# Altium schematic sheet RF-Test-Board-Sch.SchDoc
size A4; Organization: Altium Limited; Address1: L3, 12a Rodborough Rd; Address2: Frenchs Forest; Address3: NSW; Address4: Australia 2086; DocumentNumber: 1; SheetNumber: 1; SheetTotal: 7
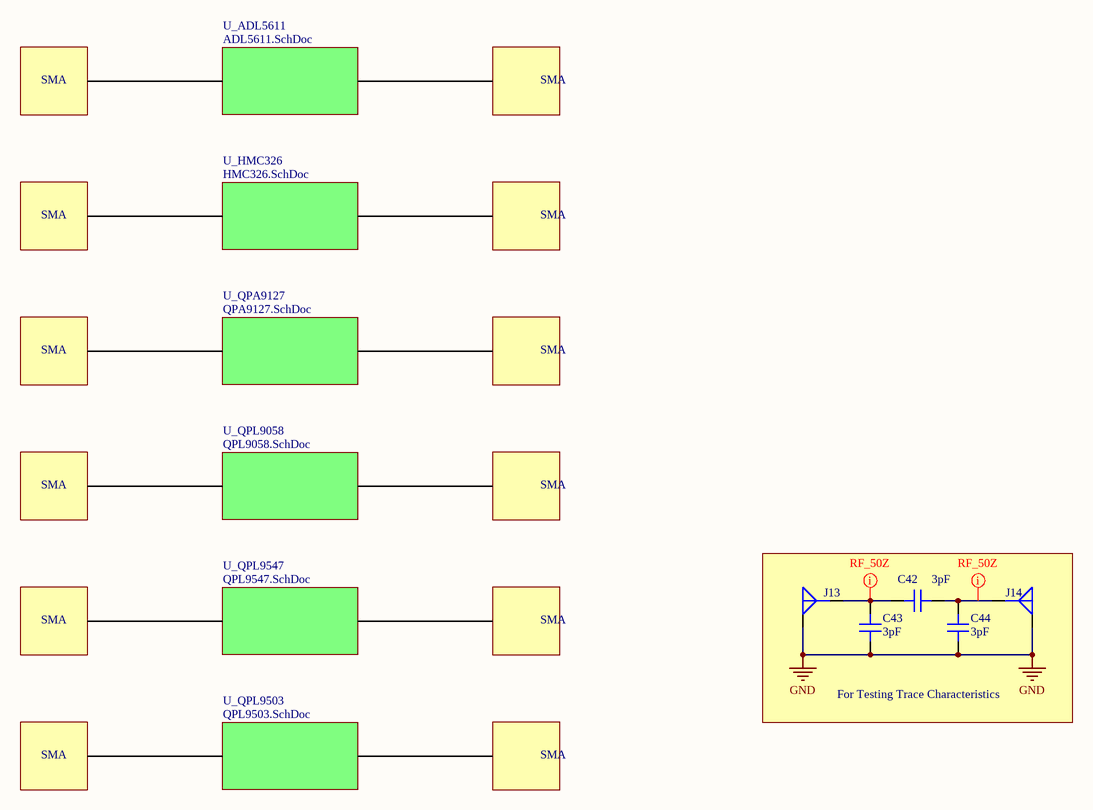
[diagram p0: RF-Test-Board-Sch.SchDoc]

## Parts
C42  3pF  [CAP 0402_1005 RF]
C43  3pF  [CAP 0402_1005 RF]
C44  3pF  [CAP 0402_1005 RF]
J13  CON-SMA-EDGE-S  [CON-SMA-EDGE-S]  (value not drawn)
J14  CON-SMA-EDGE-S  [CON-SMA-EDGE-S]  (value not drawn)

## Blocks framed on the sheet
For Testing Trace Characteristics: C42-C44 J13 J14

## Sub-sheets
U_ADL5611 = ADL5611.SchDoc: no entries
U_HMC326 = HMC326.SchDoc: no entries
U_QPA9127 = QPA9127.SchDoc: no entries
U_QPL9058 = QPL9058.SchDoc: no entries
U_QPL9503 = QPL9503.SchDoc: no entries
U_QPL9547 = QPL9547.SchDoc: no entries

## Nets
GND: C43.1 C44.1 J13.2(G) J14.2(G)
NetC42_1: C42.1 C44.2 J14.1(S)
NetC42_2: C42.2 C43.2 J13.1(S)

## Layout directives
net class RF_50Z: NetC42_1, NetC42_2

## Notes on the sheet
- SMA
- Title
- Author:
- Murat Kucukyilmaz
- Number:
- Date:
- Sheet
- of

## Library data of the parts
C42-C44 = GJM1555C1H3R0CB01J: CAP CER 3PF 50V C0G/NP0 0402; Manufacturer: Murata Electronics; Temperature Coefficient: C0G, NP0; Tolerance: ±0.25pF; Part Number: GJM1555C1H3R0CB01J; Applications: RF, Microwave, High Frequency; Capacitance: 3pF; ComponentLink1Description: Datasheet; ComponentLink1URL: https://search.murata.co.jp/Ceramy/image/img/A01X/G101/ENG/GJM1555C1H3R0CB01-01.pdf; ComponentLink2Description: DigiKey Link; ComponentLink2URL: http://digikey.com/product-detail/en/murata-electronics/GJM1555C1H3R0CB01J/490-8096-1-ND/4380382; Device Package: 0402 (1005 Metric); Features: High Q, Low Loss; LastUpdated: 2.09.2020 01:17:08; Lifecycle Status: Active; Minimum Order: 1; Mounting Type: Surface Mount, MLCC; Operating Temperature: -55°C ~ 125°C; Package / Case: 0402 (1005 Metric); Packaging: TapeAndReel; PartId: 492; Part Status: Active; Price: 0.01; Series: GJM; Size / Dimension: 0.039" L x 0.020" W (1.00mm x 0.50mm); Supplier 1: DigiKey; Supplier Part Number 1: 490-8096-1-ND; Thickness (Max): 0.022" (0.55mm); Value: 3pF; Voltage - Rated: 50V
J13 J14 = CON-SMA-EDGE-S: CONN SMA JACK STR EDGE MNT; Part Number: CON-SMA-EDGE-S; Supplier 1: Digi-Key; Supplier 2: Mouser; Supplier Part Number 1: CON-SMA-EDGE-S-ND; Supplier Part Number 2: 223-CON-SMA-EDGE-S